# EAGLE design usb_flasher (EAGLE 4.11)
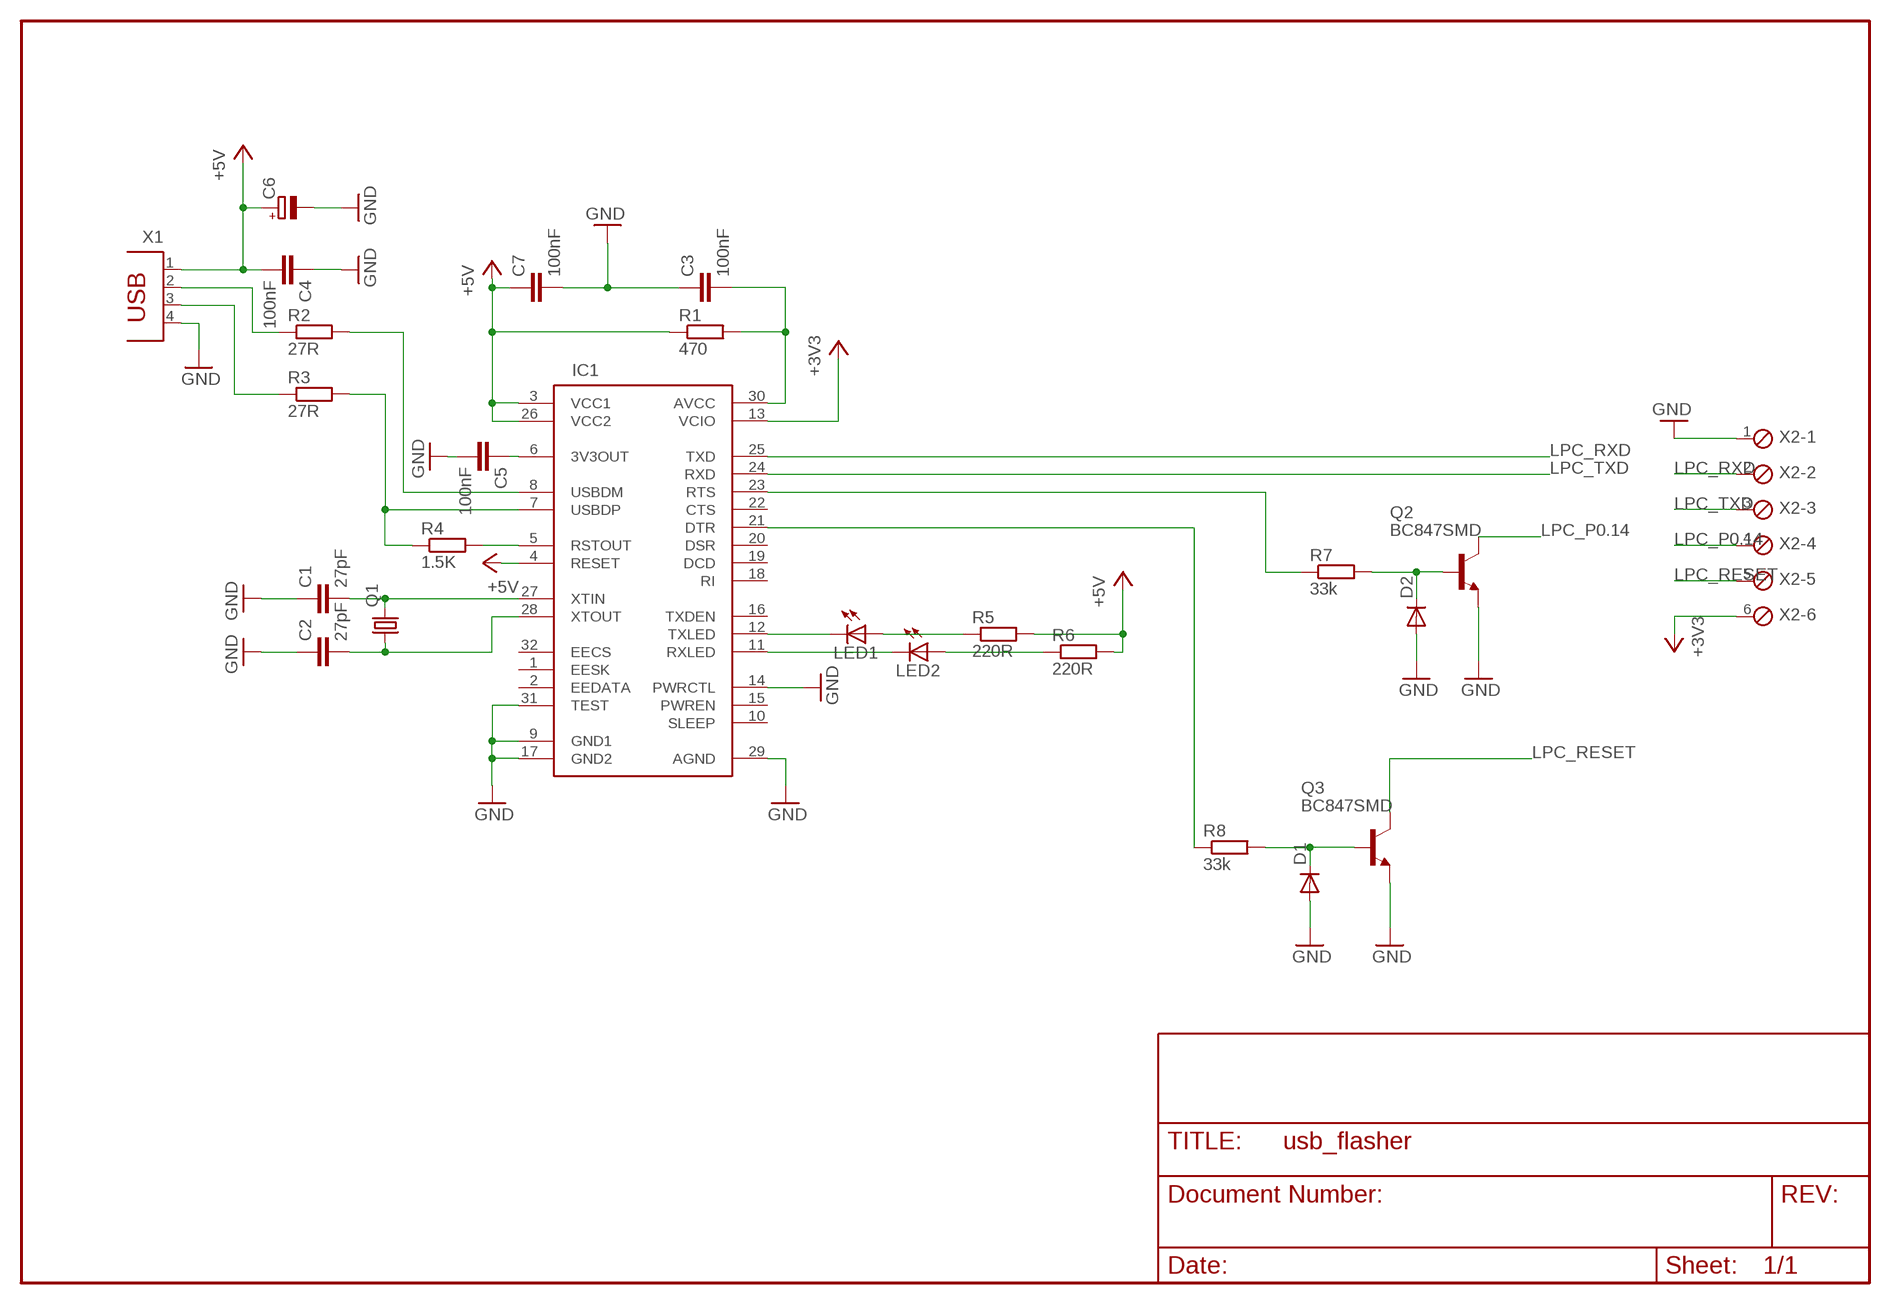
[diagram p0: schematic, sheet 1]

## Parts
C1  27pF  C-EUC0603K  [C0603K]
C2  27pF  C-EUC0603K  [C0603K]
C3  100nF  C-EUC0603K  [C0603K]
C4  100nF  C-EUC0603K  [C0603K]
C5  100nF  C-EUC0603K  [C0603K]
C6  CPOL-EUB  [PANASONIC_B]
C7  100nF  C-EUC0603K  [C0603K]
D1  DIODE-SOD80C  [SOD80C]
D2  DIODE-SOD80C  [SOD80C]
IC1  FT232BM  [QFP-32]
LED1  LEDCHIP-LED0805  [CHIP-LED0805]
LED2  LEDCHIP-LED0805  [CHIP-LED0805]
Q1  CRYTALHC49UP  [HC49UP]
Q2  BC847SMD  [SOT23]
Q3  BC847SMD  [SOT23]
R1  470  R-EU_R0603  [R0603]
R2  27R  R-EU_R0603  [R0603]
R3  27R  R-EU_R0603  [R0603]
R4  1.5K  R-EU_R0603  [R0603]
R5  220R  R-EU_R0603  [R0603]
R6  220R  R-EU_R0603  [R0603]
R7  33k  R-EU_R0603  [R0603]
R8  33k  R-EU_R0603  [R0603]
X1  PN61729  [PN61729]
X2  MPT6  [6POL254]

## Nets
+3V3: IC1.13(VCIO) X2.6
+5V: C4.2 C6.+ C7.1 IC1.3(VCC1) IC1.4(RESET) IC1.26(VCC2) R1.1 R5.2 R6.2 X1.1
GND: C1.1 C2.1 C3.1 C4.1 C5.2 C6.- C7.2 D1.A D2.A IC1.9(GND1) IC1.14(PWRCTL) IC1.17(GND2) IC1.29(AGND) IC1.31(TEST) Q2.2(E) Q3.2(E) X1.4 X2.1
LPC_P0.14: Q2.3(C) X2.4
LPC_RESET: Q3.3(C) X2.5
LPC_RXD: IC1.25(TXD) X2.2
LPC_TXD: IC1.24(RXD) X2.3
N$1: C1.2 IC1.27(XTIN) Q1.2
N$2: C2.2 IC1.28(XTOUT) Q1.1
N$3: C3.2 IC1.30(AVCC) R1.2
N$4: C5.1 IC1.6(3V3OUT)
N$5: R2.1 X1.2
N$6: R3.1 X1.3
N$7: IC1.8(USBDM) R2.2
N$8: IC1.7(USBDP) R3.2 R4.1
N$9: IC1.5(RSTOUT) R4.2
N$12: IC1.23(RTS) R7.1
N$13: IC1.21(DTR) R8.1
N$14: IC1.12(TXLED) LED1.C
N$15: IC1.11(RXLED) LED2.C
N$16: LED1.A R5.1
N$17: LED2.A R6.1
N$18: D2.C Q2.1(B) R7.2
N$19: D1.C Q3.1(B) R8.2
Unconnected: IC1.1(EESK) IC1.2(EEDATA) IC1.10(SLEEP) IC1.15(PWREN) IC1.16(TXDEN) IC1.18(RI) IC1.19(DCD) IC1.20(DSR) IC1.22(CTS) IC1.32(EECS)

## Library data of the parts
C1-C5 C7 = rcl:C-EU: CAPACITOR, European symbol
C6 = rcl:CPOL-EU: POLARIZED CAPACITOR, European symbol
D1 D2 = diode:DIODE-: DIODE
IC1 = FTDI:FT232BM: FT232BM USB-RS232 Wandler FTDI
LED1 LED2 = led:LED: LED OSRAM: - CHIPLED LG R971, LG N971, LY N971, LG Q971, LY Q971, LO R971, LY R971 LH N974, LH R974 LS Q976, LO Q976, LY Q976 LO Q996 - Hyper CHIPLED LW Q18S LB Q993, LB Q99A, LB R99A - SideLED LS A670, LO A670, LY A670, LG A670, LP A670 LB A673, LV A673, LT A673, LW A673 LH A674 LY A675 LS A676, LA A676, LO A676, LY A676, LW A676 LS A679, LY A679, LG A679 - Hyper Micro SIDELED® LS Y876, LA Y876, LO Y876, LY Y876 LT Y87S - SmartLED LW L88C, LW L88S LB L89C, LB L89S, LG L890 LS L89K, LO L89K, LY L89K LS L896, LA L896, LO L896, LY L896 - TOPLED LS T670, LO T670, LY T670, LG T670, LP T670 LSG T670, LSP T670, LSY T670, LOP T670, LYG T670 LG T671, LOG T671, LSG T671 LB T673, LV T673, LT T673, LW T673 LH T674 LS T676, LA T676, LO T676, LY T676, LB T676, LH T676, LSB T676, LW T676 LB T67C, LV T67C, LT T67C, LS T67K, LO T67K, LY T67K, LW E67C LS E67B, LA E67B, LO E67B, LY E67B, LB E67C, LV E67C, LT E67C LW T67C LS T679, LY T679, LG T679 LS T770, LO T770, LY T770, LG T770, LP T770 LB T773, LV T773, LT T773, LW T773 LH T774 LS E675, LA E675, LY E675, LS T675 LS T776, LA T776, LO T776, LY T776, LB T776 LHGB T686 LT T68C, LB T68C - Hyper Mini TOPLED® LB M676 - Mini TOPLED Santana® LG M470 LS M47K, LO M47K, LY M47K Source: http://www.osram.convergy.de/
Q1 = crystal:CRYTAL: CRYSTAL
Q2 Q3 = transistor-npn:BC847*: NPN Transistor
R1-R8 = rcl:R-EU_: RESISTOR, European symbol
X1 = con-berg:PN61729: BERG
X2 = con-phoenix-254:MPT6: PHOENIX CONNECTOR

## Board
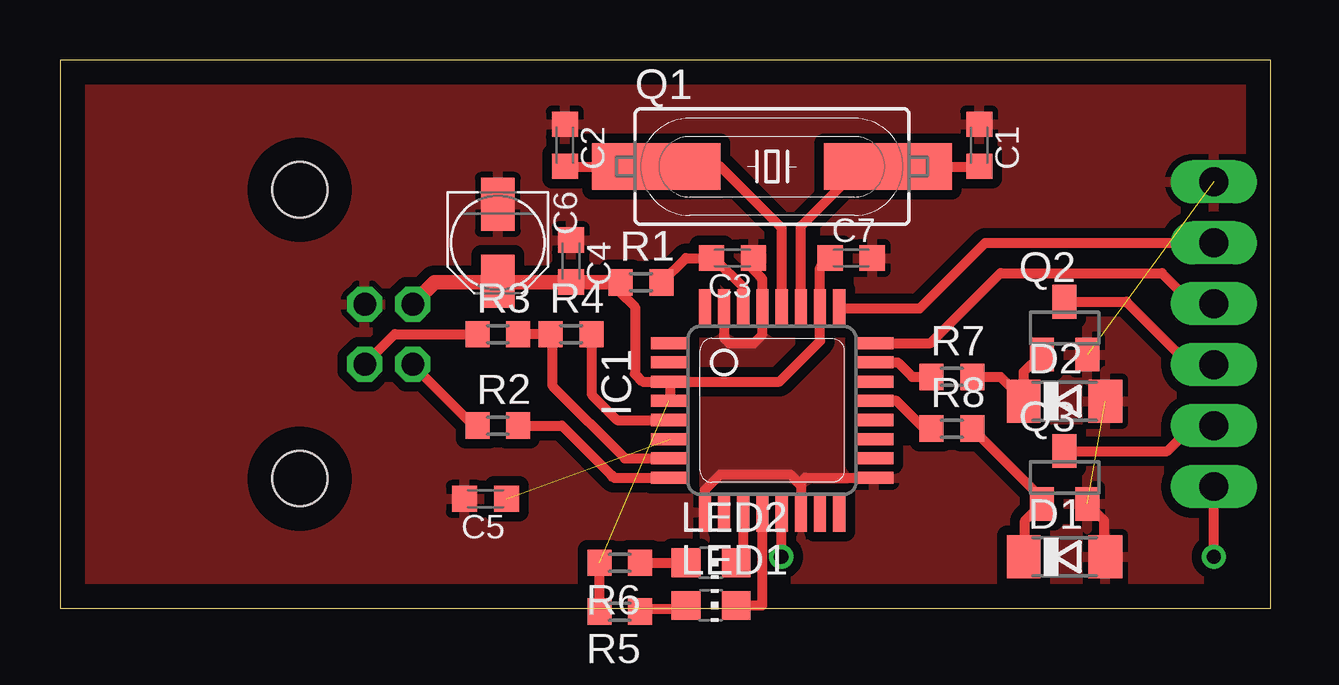
[diagram p1: board, top side]
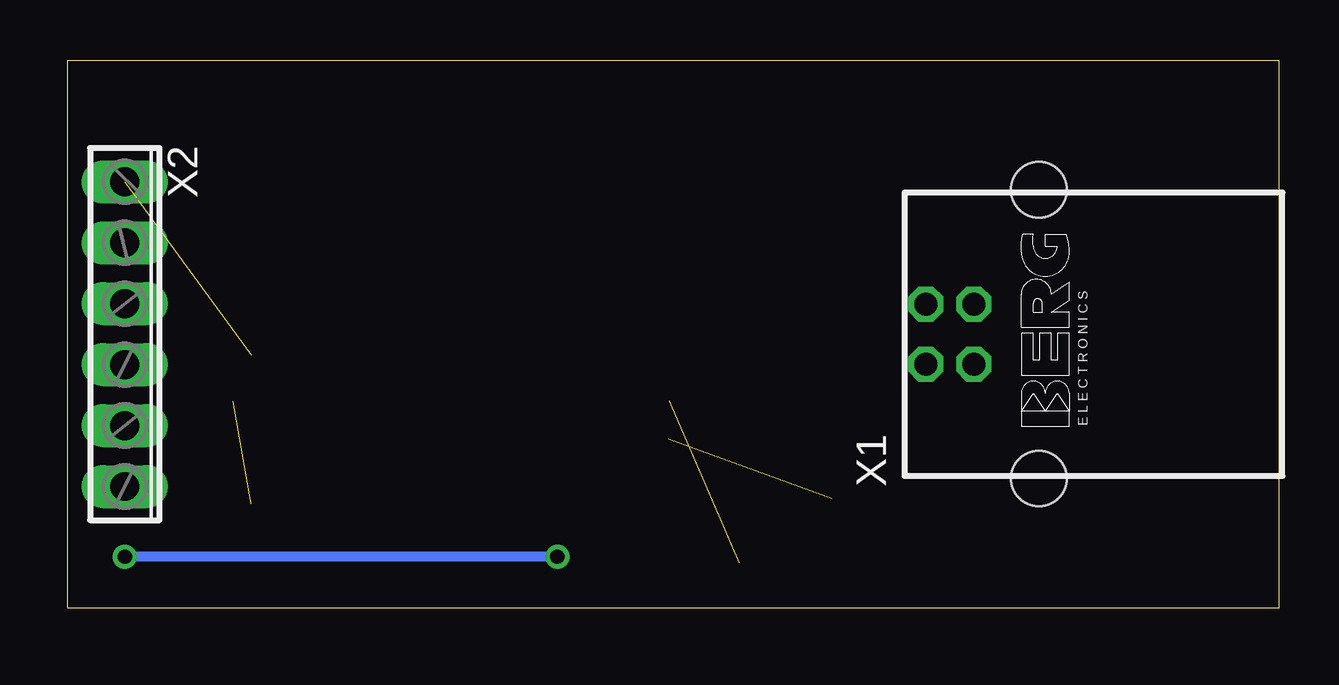
[diagram p2: board, bottom side, seen from below]

Size 50.47 x 22.85 mm. Coordinates in mm from the lower left corner, seen from the top.
Outline: 0,0 50.47,0 50.47,22.85 0,22.85 0,0
Copper layers (1*16): Top 0.035mm / dielectric 1.5mm / Bottom 0.035mm
Design rules "default": minimum track width 10mil, minimum drill 24mil, track to track 8mil, track to pad 8mil, pad to pad 8mil, via to via 8mil, smd to smd 8mil, copper to edge 40mil, drill to drill 8mil, minimum pad ring 10mil, minimum via ring 8mil, stop-mask expansion 4mil, vias tented up to drill 0mil, thermal gap 10mil

### Footprints (pad centres in the part's own frame; a part is rotated, then mirrored left to right if it is on the bottom)
C0603K = smd 1.05 x 1.08: 1 -0.875,0; 2 0.875,0
PANASONIC_B = smd 2.2 x 1.4: + 1.6,0; - -1.6,0
SOD80C = smd 1.4 x 1.8: A 1.7,0; C -1.7,0
QFP-32 = smd 0.508 x 1.6: 1 -2.8,-4.25; 2 -2,-4.25; 3 -1.2,-4.25; 4 -0.4,-4.25; 5 0.4,-4.25; 6 1.2,-4.25; 7 2,-4.25; 8 2.8,-4.25; 17 2.8,4.25; 18 2,4.25; 19 1.2,4.25; 20 0.4,4.25; 21 -0.4,4.25; 22 -1.2,4.25; 23 -2,4.25; 24 -2.8,4.25 | smd 1.6 x 0.508: 9 4.25,-2.8; 10 4.25,-2; 11 4.25,-1.2; 12 4.25,-0.4; 13 4.25,0.4; 14 4.25,1.2; 15 4.25,2; 16 4.25,2.8; 25 -4.25,2.8; 26 -4.25,2; 27 -4.25,1.2; 28 -4.25,0.4; 29 -4.25,-0.4; 30 -4.25,-1.2; 31 -4.25,-2; 32 -4.25,-2.8
CHIP-LED0805 = smd 1.2 x 1.2: A 0,-1.05; C 0,1.05
HC49UP = smd 5.334 x 1.93: 1 -4.826,0; 2 4.826,0
SOT23 = smd 1 x 1.4: 1 -0.95,-1.1; 2 0.95,-1.1; 3 0,1.1
R0603 = smd 1 x 1.1: 1 -0.85,0; 2 0.85,0
PN61729 = drill 0.95 octagon: 1 1.25,4.71; 2 -1.25,4.71; 3 -1.25,2.71; 4 1.25,2.71 | hole 2.3: -6.02,0; 6.02,0
6POL254 = drill 1.2 pad 1.778 long: 1 -6.35,0; 2 -3.81,0; 3 -1.27,0; 4 1.27,0; 5 3.81,0; 6 6.35,0

### Placement (x,y rotation side)
C1  38.32,19.3 270 top
C2  21.04,19.3 270 top
C3  28.03,14.6 180 top
C4  21.3,14.47 270 top
C5  17.74,4.57 180 top
C6  18.25,15.24 270 top
C7  32.98,14.6 0 top
D1  41.87,2.15 0 top
D2  41.87,8.63 0 top
IC1  29.68,8.25 270 top
LED1  27.14,0.12 270 top
LED2  27.14,1.9 270 top
Q1  29.68,18.41 0 top
Q2  41.87,11.68 0 top
Q3  41.87,5.46 0 top
R1  24.22,13.58 0 top
R2  18.25,7.61 0 top
R3  18.25,11.43 0 top
R4  21.3,11.43 0 top
R5  23.33,-0.13 180 top
R6  23.33,1.9 180 top
R7  37.17,9.65 0 top
R8  37.17,7.49 0 top
X1  9.99,11.43 90 bottom
X2  48.1,11.43 270 bottom

### Tracks (layer width: path | path; a pad name or v marks a point on that pad's centre or on a via)
+3V3  (via drill 0.6)
  Top 0.406: IC1.13 30.08,2.17 v30.06,2.15 | v48.1,2.15 X2.6
  Bottom 0.406: v30.06,2.15 v48.1,2.15
+5V  (1 unrouted)
  Top 0.406: C7.1 32.09,14.6 31.68,14.19 IC1.26 31.68,11.14 29.99,9.45 IC1.3 | R5.2 22.48,-0.22 | 22.48,-0.22 R6.2 | 22.48,-0.22 22.44,-0.26 | IC1.3 24.29,9.45 23.96,9.77 23.96,12.57 23.33,13.2 23.37,13.24 R1.1 | 25.38,8.65 25.36,8.63 | 25.38,8.65 IC1.4 | IC1.3 25.43,8.7 25.38,8.65
  Top 0.61: X1.1 15.61,13.58 18.25,13.58 | 18.25,13.58 C6.+ | 18.25,13.58 21.28,13.58 C4.2 21.31,13.58 R1.1 23.46,13.58
GND  (2 unrouted)
  Top 0.406: D1.A 43.52,2.15 43.52,3.66 Q3.2 | IC1.31 27.68,11.27 27.9,11.04 28.92,11.04 29.28,11.41 IC1.29 29.28,13.73 28.92,14.09 28.92,14.47 28.9,14.49 C3.1 | IC1.9 26.88,4.94 27.52,5.58 30.44,5.58 30.82,5.2 | 30.82,5.2 30.88,5.14 30.88,4.12 30.82,4.06 IC1.14 | IC1.17 31.07,5.45 30.82,5.2
  pour Top (isolate 0.406): 50.89,23.24 -0.42,23.24 -0.42,-0.39 50.89,-0.39
LPC_P0.14
  Top 0.406: Q2.3 44.46,12.78 47.08,10.15 X2.4
LPC_RESET
  Top 0.406: Q3.3 46.15,6.56 47.21,7.61 X2.5
LPC_RXD
  Top 0.406: IC1.25 35.84,12.5 38.57,15.24 X2.2
LPC_TXD
  Top 0.406: IC1.24 36.29,11.05 39.21,13.96 45.94,13.96 47.08,12.82 48.1,12.82 X2.3
N$1
  Top 0.406: IC1.27 30.88,15.93 33.36,18.41 Q1.2 38.44,18.41 C1.2
N$2
  Top 0.406: IC1.28 30.08,15.85 27.52,18.41 Q1.1 C2.2
N$3
  Top 0.406: IC1.30 28.48,13.39 27.27,14.6 C3.2 26.09,14.6 R1.2
N$4  (1 unrouted)
N$5
  Top 0.406: R2.1 17.23,7.61 14.7,10.14 X1.2
N$6
  Top 0.406: X1.3 13.95,11.43 R3.1 17.49,11.43
N$7
  Top 0.406: R2.2 20.92,7.61 22.95,5.58 | 22.95,5.58 23.08,5.46 | IC1.8 23.08,5.45 22.95,5.58
N$8
  Top 0.406: R3.2 R4.1 20.54,11.43 20.54,9.27 23.55,6.25 IC1.7
N$9
  Top 0.406: IC1.5 23.22,7.85 22.19,8.89 22.19,11.3 22.15,11.34 R4.2
N$12
  Top 0.406: IC1.23 34.92,10.25 35.52,9.65 R7.1
N$13
  Top 0.406: R8.1 36.03,7.49 34.87,8.65 IC1.21
N$14
  Top 0.406: 28.03,0.12 LED1.C 29.28,0.12 IC1.12
N$15
  Top 0.406: 28.16,1.9 LED2.C 28.48,1.9 IC1.11
N$16
  Top 0.406: 26.09,0 26.38,0 | 26.09,0 LED1.A | R5.1 24.18,0 26.09,0
N$17
  Top 0.406: R6.1 LED2.A
N$18
  Top 0.406: R7.2 39.21,9.65 40.22,8.63 D2.C 40.17,9.85 40.9,10.58 Q2.1
N$19
  Top 0.406: R8.2 40.86,4.66 40.86,4.31 40.88,4.31 Q3.1 40.22,3.66 40.22,2.2 D1.C